# EAGLE schematic BSPD (EAGLE 8.4.1)
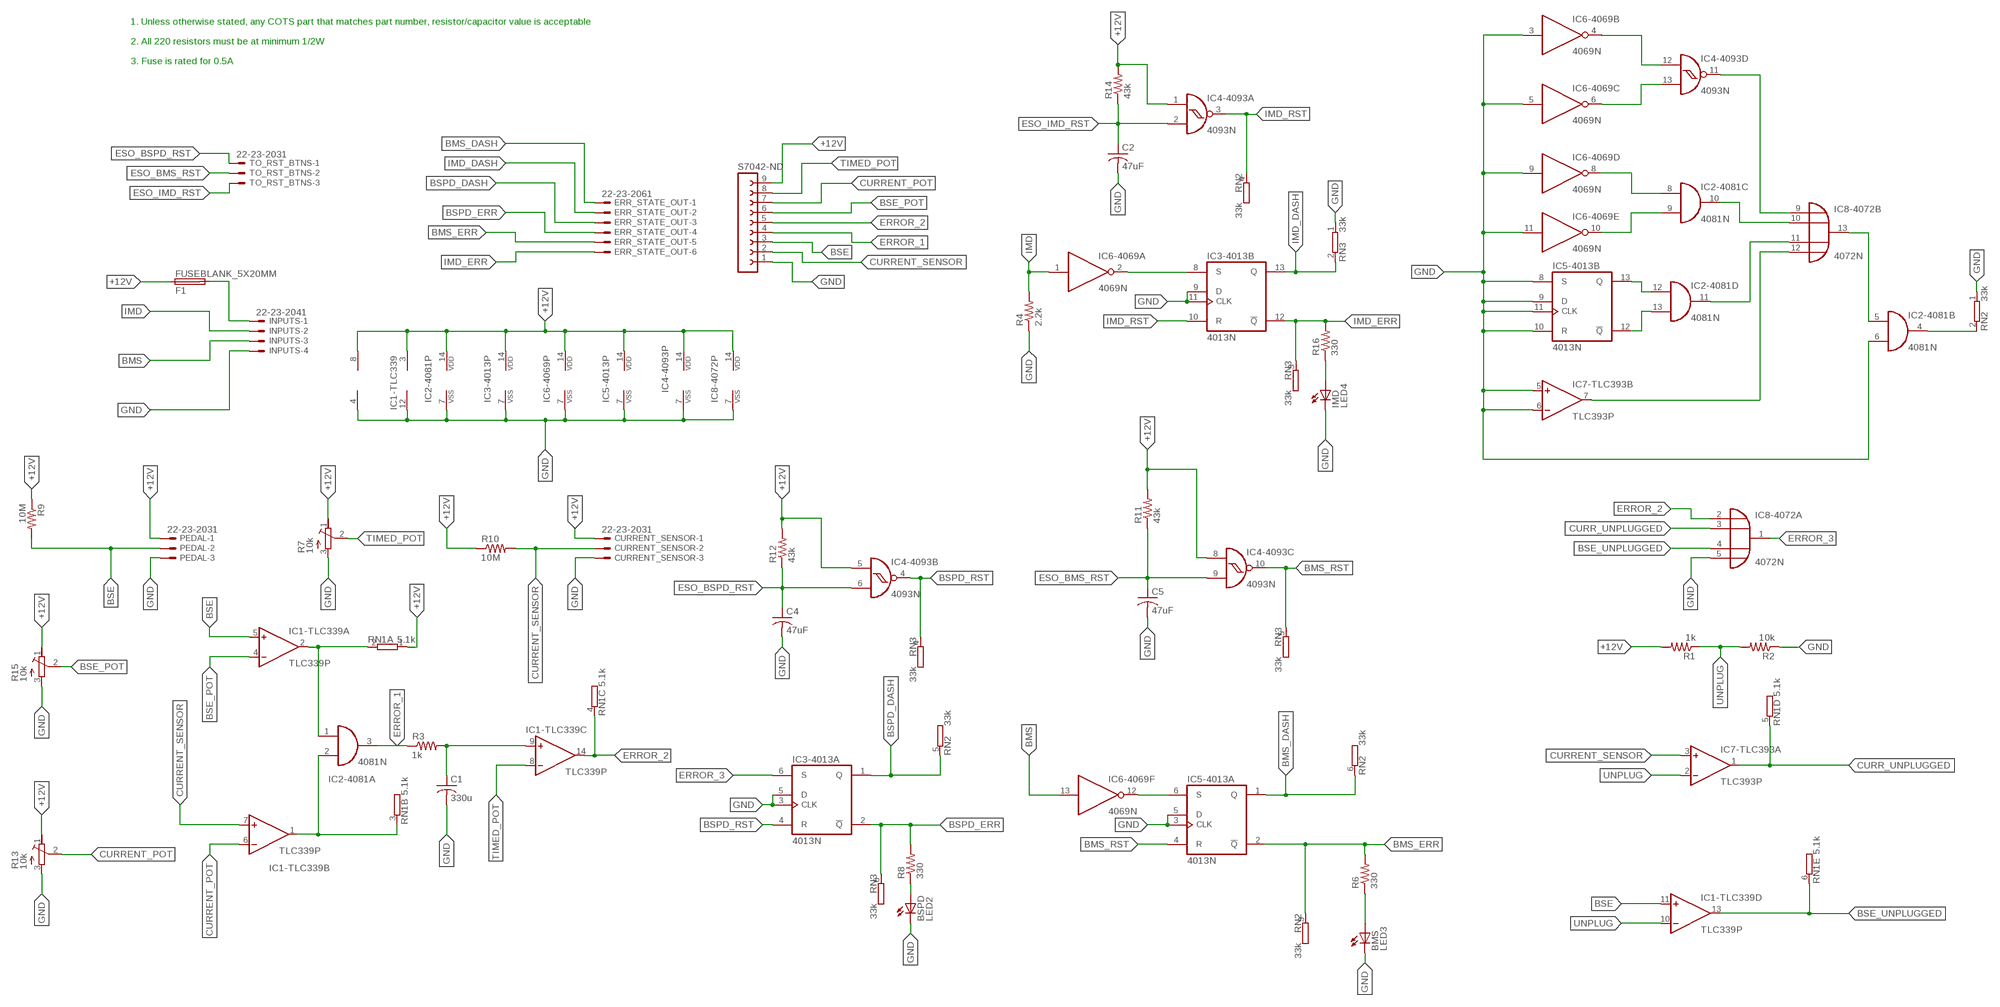
[diagram p0: schematic, sheet 1]

## Parts
BMS  LED3  LED3MM  [LED3MM]
BSPD  LED2  LED3MM  [LED3MM]
C1  330u  C-US225-108X268  [C225-108X268]
C2  47uF  C-US050-024X044  [C050-024X044]
C4  47uF  C-US050-024X044  [C050-024X044]
C5  47uF  C-US050-024X044  [C050-024X044]
CURRENT_SENSOR  22-23-2031  [22-23-2031]
ERR_STATE_OUT  22-23-2061  [22-23-2061]
F1  FUSEBLANK_5X20MM  [FUSE_HOLDER_5X20MM]
IC1-TLC339  TLC339P  [DIL14]
IC2-4081  4081N  [DIL14]
IC3-4013  4013N  [DIL14]
IC4-4093  4093N  [DIL14]
IC5-4013  4013N  [DIL14]
IC6-4069  4069N  [DIL14]
IC7-TLC393  TLC393P  [DIL08]
IC8-4072  4072N  [DIL14]
IMD  LED4  LED3MM  [LED3MM]
INPUTS  22-23-2041  [22-23-2041]
PEDAL  22-23-2031  [22-23-2031]
R1  1k  R-US_0207/12  [0207/12]
R2  10k  R-US_0207/12  [0207/12]
R3  1k  R-US_0207/12  [0207/12]
R4  2.2k  R-US_0207/12  [0207/12]
R6  330  R-US_0207/12  [0207/12]
R7  10k  R-TRIMM3006P  [RTRIM3006P]
R8  330  R-US_0207/12  [0207/12]
R9  10M  R-US_0207/12  [0207/12]
R10  10M  R-US_0207/12  [0207/12]
R11  43k  R-US_0207/12  [0207/12]
R12  43k  R-US_0207/12  [0207/12]
R13  10k  R-TRIMM3006P  [RTRIM3006P]
R14  43k  R-US_0207/12  [0207/12]
R15  10k  R-TRIMM3006P  [RTRIM3006P]
R16  330  R-US_0207/12  [0207/12]
RN1  5.1k  GE05R  [SIL6]
RN2  33k  GE05RP  [SIL6]
RN3  33k  GE05RP  [SIL6]
S7042-ND  FE09W  [FE09W]
TO_RST_BTNS  22-23-2031  [22-23-2031]

## Nets
+12V: CURRENT_SENSOR.1 F1.1 IC1-TLC339.3(P:V+) IC2-4081.14(P:VDD) IC3-4013.14(P:VDD) IC4-4093.1(A:I0) IC4-4093.5(B:I0) IC4-4093.8(C:I0) IC4-4093.14(P:VDD) IC5-4013.14(P:VDD) IC6-4069.14(P:VDD) IC7-TLC393.8(P:V+) IC8-4072.14(P:VDD) PEDAL.1 R1.2 R7.1(E) R9.1 R10.1 R11.2 R12.2 R13.1(E) R14.2 R15.1(E) RN1.1 S7042-ND.9
BMS: IC6-4069.13(F:I) INPUTS.3
BMS_DASH: ERR_STATE_OUT.1 IC5-4013.1(A:Q) RN2.6
BMS_ERR: ERR_STATE_OUT.5 IC5-4013.2(A:!Q) R6.2 RN2.3
BMS_RST: IC4-4093.10(C:O) IC5-4013.4(A:R) RN3.5
BSE: IC1-TLC339.5(A:+IN) IC1-TLC339.11(D:+IN) PEDAL.2 R9.2 S7042-ND.3
BSE_POT: IC1-TLC339.4(A:-IN) R15.2(S) S7042-ND.6
BSE_UNPLUGGED: IC1-TLC339.13(D:OUT) IC8-4072.4(A:I2) RN1.6
BSPD_DASH: ERR_STATE_OUT.3 IC3-4013.1(A:Q) RN2.5
BSPD_ERR: ERR_STATE_OUT.4 IC3-4013.2(A:!Q) R8.2 RN3.6
BSPD_RST: IC3-4013.4(A:R) IC4-4093.4(B:O) RN3.4
CURR_UNPLUGGED: IC7-TLC393.1(A:OUT) IC8-4072.3(A:I1) RN1.5
CURRENT_POT: IC1-TLC339.6(B:-IN) R13.2(S) S7042-ND.7
CURRENT_SENSOR: CURRENT_SENSOR.2 IC1-TLC339.7(B:+IN) IC7-TLC393.3(A:+IN) R10.2 S7042-ND.2
ERROR_1: IC2-4081.3(A:O) R3.1 S7042-ND.4
ERROR_2: IC1-TLC339.14(C:OUT) IC8-4072.2(A:I0) RN1.4 S7042-ND.5
ERROR_3: IC3-4013.6(A:S) IC8-4072.1(A:O)
ESO_BMS_RST: C5.1 IC4-4093.9(C:I1) R11.1 TO_RST_BTNS.2
ESO_BSPD_RST: C4.1 IC4-4093.6(B:I1) R12.1 TO_RST_BTNS.1
ESO_IMD_RST: C2.1 IC4-4093.2(A:I1) R14.1 TO_RST_BTNS.3
GND: BMS.K(C) BSPD.K(C) C1.2 C2.2 C4.2 C5.2 CURRENT_SENSOR.3 IC1-TLC339.12(P:V-) IC2-4081.6(B:I1) IC2-4081.7(P:VSS) IC3-4013.3(A:CLK) IC3-4013.5(A:D) IC3-4013.7(P:VSS) IC3-4013.9(B:D) IC3-4013.11(B:CLK) IC4-4093.7(P:VSS) IC5-4013.3(A:CLK) IC5-4013.5(A:D) IC5-4013.7(P:VSS) IC5-4013.8(B:S) IC5-4013.9(B:D) IC5-4013.10(B:R) IC5-4013.11(B:CLK) IC6-4069.3(B:I) IC6-4069.5(C:I) IC6-4069.7(P:VSS) IC6-4069.9(D:I) IC6-4069.11(E:I) IC7-TLC393.4(P:V-) IC7-TLC393.5(B:+IN) IC7-TLC393.6(B:-IN) IC8-4072.5(A:I3) IC8-4072.7(P:VSS) IMD.K(C) INPUTS.4 PEDAL.3 R2.1 R4.1 R7.3(A) R13.3(A) R15.3(A) RN2.1 RN3.1 S7042-ND.1
IMD: IC6-4069.1(A:I) INPUTS.2 R4.2
IMD_DASH: ERR_STATE_OUT.2 IC3-4013.13(B:Q) RN3.2
IMD_ERR: ERR_STATE_OUT.6 IC3-4013.12(B:!Q) R16.2 RN3.3
IMD_RST: IC3-4013.10(B:R) IC4-4093.3(A:O) RN2.4
N$1: IC1-TLC339.2(A:OUT) IC2-4081.1(A:I0) RN1.2
N$2: IC1-TLC339.1(B:OUT) IC2-4081.2(A:I1) RN1.3
N$4: F1.2 INPUTS.1
N$5: IC3-4013.8(B:S) IC6-4069.2(A:O)
N$6: C1.1 IC1-TLC339.9(C:+IN) R3.2
N$7: IC7-TLC393.7(B:OUT) IC8-4072.12(B:I3)
N$8: IC4-4093.11(D:O) IC8-4072.9(B:I0)
N$9: BMS.A R6.1
N$10: IC4-4093.12(D:I0) IC6-4069.4(B:O)
N$11: IC2-4081.10(C:O) IC8-4072.10(B:I1)
N$12: IC2-4081.11(D:O) IC8-4072.11(B:I2)
N$13: IC4-4093.13(D:I1) IC6-4069.6(C:O)
N$14: IC5-4013.6(A:S) IC6-4069.12(F:O)
N$15: IMD.A R16.1
N$16: IC2-4081.9(C:I1) IC6-4069.10(E:O)
N$17: IC2-4081.8(C:I0) IC6-4069.8(D:O)
N$19: IC2-4081.5(B:I0) IC8-4072.13(B:O)
N$21: BSPD.A R8.1
N$22: IC2-4081.12(D:I0) IC5-4013.13(B:Q)
N$23: IC2-4081.13(D:I1) IC5-4013.12(B:!Q)
N$24: IC2-4081.4(B:O) RN2.2
TIMED_POT: IC1-TLC339.8(C:-IN) R7.2(S) S7042-ND.8
UNPLUG: IC1-TLC339.10(D:-IN) IC7-TLC393.2(A:-IN) R1.1 R2.2

## Notes on the sheet
- 1. Unless otherwise stated, any COTS part that matches part number, resistor/capacitor value is acceptable
- 2. All 220 resistors must be at minimum 1/2W
- 3. Fuse is rated for 0.5A
- IC1-TLC339

## Library data of the parts
BMS BSPD IMD = led:LED: LED OSRAM: - CHIPLED LG R971, LG N971, LY N971, LG Q971, LY Q971, LO R971, LY R971 LH N974, LH R974 LS Q976, LO Q976, LY Q976 LO Q996 - Hyper CHIPLED LW Q18S LB Q993, LB Q99A, LB R99A - SideLED LS A670, LO A670, LY A670, LG A670, LP A670 LB A673, LV A673, LT A673, LW A673 LH A674 LY A675 LS A676, LA A676, LO A676, LY A676, LW A676 LS A679, LY A679, LG A679 - Hyper Micro SIDELED® LS Y876, LA Y876, LO Y876, LY Y876 LT Y87S - SmartLED LW L88C, LW L88S LB L89C, LB L89S, LG L890 LS L89K, LO L89K, LY L89K LS L896, LA L896, LO L896, LY L896 - TOPLED LS T670, LO T670, LY T670, LG T670, LP T670 LSG T670, LSP T670, LSY T670, LOP T670, LYG T670 LG T671, LOG T671, LSG T671 LB T673, LV T673, LT T673, LW T673 LH T674 LS T676, LA T676, LO T676, LY T676, LB T676, LH T676, LSB T676, LW T676 LB T67C, LV T67C, LT T67C, LS T67K, LO T67K, LY T67K, LW E67C LS E67B, LA E67B, LO E67B, LY E67B, LB E67C, LV E67C, LT E67C LW T67C LS T679, LY T679, LG T679 LS T770, LO T770, LY T770, LG T770, LP T770 LB T773, LV T773, LT T773, LW T773 LH T774 LS E675, LA E675, LY E675, LS T675 LS T776, LA T776, LO T776, LY T776, LB T776 LHGB T686 LT T68C, LB T68C - Hyper Mini TOPLED® LB M676 - Mini TOPLED Santana® LG M470 LS M47K, LO M47K, LY M47K Source: http://www.osram.convergy.de LUXEON: - LUMILED® LXK2-PW12-R00, LXK2-PW12-S00, LXK2-PW14-U00, LXK2-PW14-V00 LXK2-PM12-R00, LXK2-PM12-S00, LXK2-PM14-U00 LXK2-PE12-Q00, LXK2-PE12-R00, LXK2-PE12-S00, LXK2-PE14-T00, LXK2-PE14-U00 LXK2-PB12-K00, LXK2-PB12-L00, LXK2-PB12-M00, LXK2-PB14-N00, LXK2-PB14-P00, LXK2-PB14-Q00 LXK2-PR12-L00, LXK2-PR12-M00, LXK2-PR14-Q00, LXK2-PR14-R00 LXK2-PD12-Q00, LXK2-PD12-R00, LXK2-PD12-S00 LXK2-PH12-R00, LXK2-PH12-S00 LXK2-PL12-P00, LXK2-PL12-Q00, LXK2-PL12-R00 Source: www.luxeon.com KINGBRIGHT: KA-3528ASYC Source: www.kingbright.com
C1 C2 C4 C5 = rcl:C-US: CAPACITOR, American symbol; SPICEPREFIX: C
CURRENT_SENSOR PEDAL TO_RST_BTNS = con-molex:22-23-2031: .100" (2.54mm) Center Header - 3 Pin; MF: MOLEX; MPN: 22-23-2031; OC_FARNELL: 1462950; OC_NEWARK: 30C0862
ERR_STATE_OUT = con-molex:22-23-2061: .100" (2.54mm) Center Header - 6 Pin; MF: MOLEX; MPN: 22-23-2061; OC_FARNELL: 1462922; OC_NEWARK: 27C1933
F1 = fuse:FUSE: Fuse; OC_FARNELL: unknown; OC_NEWARK: unknown
IC1-TLC339 = linear:TLC339: COMPARATOR
IC2-4081 = 40xx:4081: Quad 2-input AND
IC3-4013 IC5-4013 = 40xx:4013: Dual D FLIP FLOP, set/reset
IC4-4093 = 40xx:4093: Quad 2-input NAND schmitt trigger
IC6-4069 = 40xx:4069: Hex INVERTER
IC7-TLC393 = linear:TLC393: COMPARATOR
IC8-4072 = 40xx:4072: Dual 4-input OR
INPUTS = con-molex:22-23-2041: .100" (2.54mm) Center Header - 4 Pin; MF: MOLEX; MPN: 22-23-2041; OC_FARNELL: 1462920; OC_NEWARK: 38C0355
R1-R4 R6 R8-R12 R14 R16 = rcl:R-US_: RESISTOR, American symbol; SPICEPREFIX: R
R7 R13 R15 = rcl:R-TRIMM: Trimm resistor; SPICEMODEL: X; SPICEPREFIXL: POT
RN1 = resistor-sil:GE05R: SIL RESISTOR; OC_FARNELL: unknown; OC_NEWARK: unknown
RN2 RN3 = resistor-sil:GE05RP: SIL RESISTOR; OC_FARNELL: unknown; OC_NEWARK: unknown
S7042-ND = con-lsta:FE09W: FEMALE HEADER; OC_FARNELL: unknown; OC_NEWARK: unknown